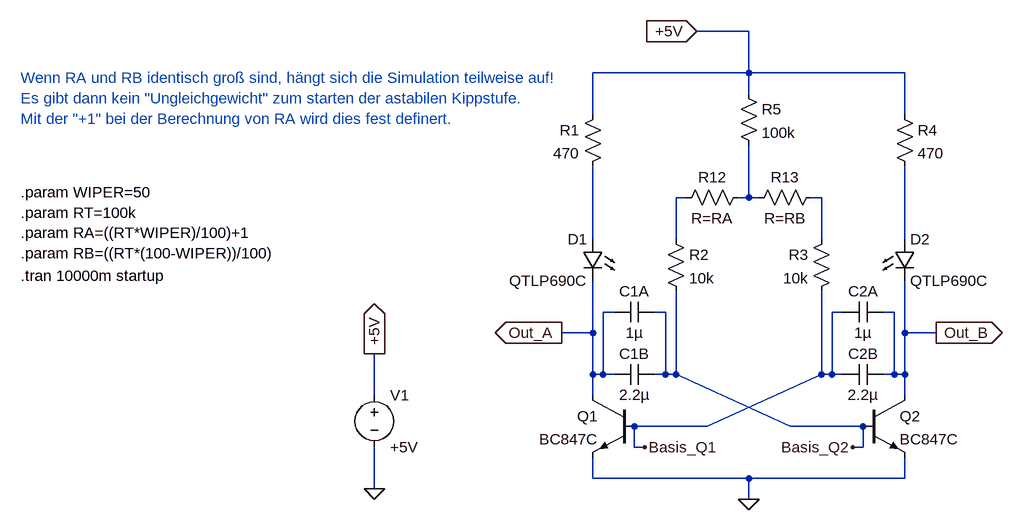
[diagram p0: schematic Projekt_8_Astabiler_Multivibrator.asc]
Projekt_8_Astabiler_Multivibrator.asc, the LTspice schematic file:
Version 4
SHEET 1 1976 680
WIRE 80 -496 0 -496
WIRE 80 -432 80 -496
WIRE 80 -432 -160 -432
WIRE 320 -432 80 -432
WIRE 80 -400 80 -432
WIRE -160 -368 -160 -432
WIRE 320 -368 320 -432
WIRE -16 -240 -32 -240
WIRE 80 -240 80 -320
WIRE 80 -240 64 -240
WIRE 96 -240 80 -240
WIRE 192 -240 176 -240
WIRE -160 -176 -160 -288
WIRE -32 -176 -32 -240
WIRE 192 -176 192 -240
WIRE 320 -176 320 -288
WIRE -128 -64 -144 -64
WIRE -48 -64 -64 -64
WIRE 224 -64 208 -64
WIRE 304 -64 288 -64
WIRE -160 -32 -160 -112
WIRE -160 -32 -208 -32
WIRE 320 -32 320 -112
WIRE 368 -32 320 -32
WIRE -160 32 -160 -32
WIRE -144 32 -144 -64
WIRE -144 32 -160 32
WIRE -128 32 -144 32
WIRE -48 32 -48 -64
WIRE -48 32 -64 32
WIRE -32 32 -32 -96
WIRE -32 32 -48 32
WIRE 192 32 192 -96
WIRE 208 32 208 -64
WIRE 208 32 192 32
WIRE 224 32 208 32
WIRE 304 32 304 -64
WIRE 304 32 288 32
WIRE 320 32 320 -32
WIRE 320 32 304 32
WIRE -496 64 -496 0
WIRE -160 64 -160 32
WIRE 320 64 320 32
WIRE 16 112 192 32
WIRE 16 112 -96 112
WIRE 144 112 -32 32
WIRE 256 112 144 112
WIRE -96 144 -96 112
WIRE -80 144 -96 144
WIRE 256 144 256 112
WIRE 256 144 240 144
WIRE -160 192 -160 160
WIRE 80 192 -160 192
WIRE 320 192 320 160
WIRE 320 192 80 192
WIRE -496 208 -496 144
WIRE 80 224 80 192
FLAG -496 208 0
FLAG -496 0 +5V
IOPIN -496 0 Out
FLAG 0 -496 +5V
IOPIN 0 -496 In
FLAG 80 224 0
FLAG -208 -32 Out_A
IOPIN -208 -32 Out
FLAG 368 -32 Out_B
IOPIN 368 -32 Out
FLAG 240 144 Basis_Q2
FLAG -80 144 Basis_Q1
SYMBOL npn 256 64 R0
SYMATTR InstName Q2
SYMATTR Value BC847C
SYMBOL npn -96 64 M0
SYMATTR InstName Q1
SYMATTR Value BC847C
SYMBOL res -144 -384 M0
SYMATTR InstName R1
SYMATTR Value 470
SYMBOL res -48 -192 R0
SYMATTR InstName R2
SYMATTR Value 10k
SYMBOL res 208 -192 M0
SYMATTR InstName R3
SYMATTR Value 10k
SYMBOL res 304 -384 R0
SYMATTR InstName R4
SYMATTR Value 470
SYMBOL cap -64 16 R90
WINDOW 0 0 32 VBottom 2
WINDOW 3 32 32 VTop 2
SYMATTR InstName C1B
SYMATTR Value 2.2µ
SYMBOL cap 224 48 R270
WINDOW 0 32 32 VTop 2
WINDOW 3 0 32 VBottom 2
SYMATTR InstName C2B
SYMATTR Value 2.2µ
SYMBOL voltage -496 48 R0
WINDOW 123 0 0 Left 2
WINDOW 39 0 0 Left 2
SYMATTR InstName V1
SYMATTR Value +5V
SYMBOL LED -144 -176 M0
SYMATTR InstName D1
SYMATTR Value QTLP690C
SYMBOL LED 304 -176 R0
SYMATTR InstName D2
SYMATTR Value QTLP690C
SYMBOL res 64 -416 R0
SYMATTR InstName R5
SYMATTR Value 100k
SYMBOL res 80 -256 R90
WINDOW 0 0 56 VBottom 2
WINDOW 3 32 56 VTop 2
SYMATTR InstName R12
SYMATTR Value R=RA
SYMBOL res 80 -224 R270
WINDOW 0 32 56 VTop 2
WINDOW 3 0 56 VBottom 2
SYMATTR InstName R13
SYMATTR Value R=RB
SYMBOL cap -64 -80 R90
WINDOW 0 0 32 VBottom 2
WINDOW 3 32 32 VTop 2
SYMATTR InstName C1A
SYMATTR Value 1µ
SYMBOL cap 224 -48 R270
WINDOW 0 32 32 VTop 2
WINDOW 3 0 32 VBottom 2
SYMATTR InstName C2A
SYMATTR Value 1µ
TEXT -1040 -120 Left 2 !.tran 10000m startup
TEXT -1040 -248 Left 2 !.param WIPER=50\n.param RT=100k\n.param RA=((RT*WIPER)/100)+1\n.param RB=((RT*(100-WIPER))/100)
TEXT -1040 -424 Left 2 ;Wenn RA und RB identisch groß sind, hängt sich die Simulation teilweise auf!\nEs gibt dann kein "Ungleichgewicht" zum starten der astabilen Kippstufe.\nMit der "+1" bei der Berechnung von RA wird dies fest definert.

The netlist it stands for:
* Projekt_8_Astabiler_Multivibrator.asc
Q2 Out_B Basis_Q2 0 0 BC847C
Q1 Out_A Basis_Q1 0 0 BC847C
R1 +5V N004 470
R2 N001 Basis_Q2 10k
R3 N003 Basis_Q1 10k
R4 +5V N005 470
C1B Basis_Q2 Out_A 2.2µ
C2B Basis_Q1 Out_B 2.2µ
V1 +5V 0 +5V
D1 N004 Out_A QTLP690C
D2 N005 Out_B QTLP690C
R5 +5V N002 100k
R12 N002 N001 R=RA
R13 N002 N003 R=RB
C1A Basis_Q2 Out_A 1µ
C2A Basis_Q1 Out_B 1µ
.model D D
.lib standard.dio
.model NPN NPN
.model PNP PNP
.lib standard.bjt
.tran 10000m startup
.param WIPER=50
.param RT=100k
.param RA=((RT*WIPER)/100)+1
.param RB=((RT*(100-WIPER))/100)
* Wenn RA und RB identisch groß sind, hängt sich die Simulation teilweise auf!
* Es gibt dann kein "Ungleichgewicht" zum starten der astabilen Kippstufe.
* Mit der "+1" bei der Berechnung von RA wird dies fest definert.
.backanno
.end